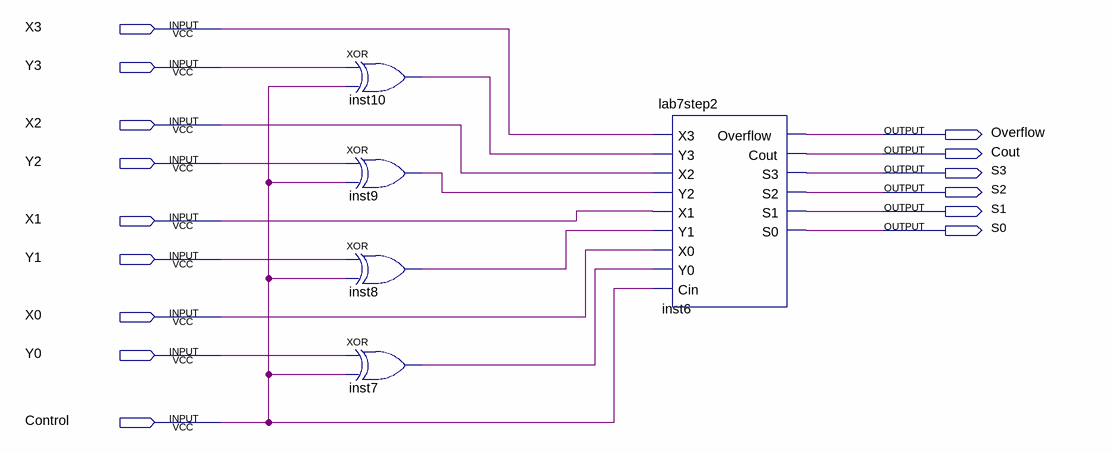
[diagram p0: schematic sheet]
// Quartus schematic Adder-Subtractor.bdf as structural Verilog: 5 symbols, 15 pins
module \Adder-Subtractor  (
  input  X3,
  input  Y3,
  input  X2,
  input  Y2,
  input  X1,
  input  Y1,
  input  X0,
  input  Y0,
  input  Control,
  output Overflow,
  output Cout,
  output S3,
  output S2,
  output S1,
  output S0
);

  wire inst7_out, inst8_out, inst9_out, inst10_out;

  xor inst10 (inst10_out, Y3, Control);
  xor inst9 (inst9_out, Y2, Control);
  xor inst8 (inst8_out, Y1, Control);
  xor inst7 (inst7_out, Y0, Control);
  lab7step2 inst6 (
    .X3(X3), .Y3(inst10_out), .X2(X2), .Y2(inst9_out), .X1(X1), .Y1(inst8_out), .X0(X0), .Y0(inst7_out),
    .Cin(Control), .Overflow(Overflow), .Cout(Cout), .S3(S3), .S2(S2), .S1(S1), .S0(S0));
endmodule
